# EAGLE schematic Aux Power Board V2.1 (EAGLE 9.6.2)

## Sheet 1 of 2
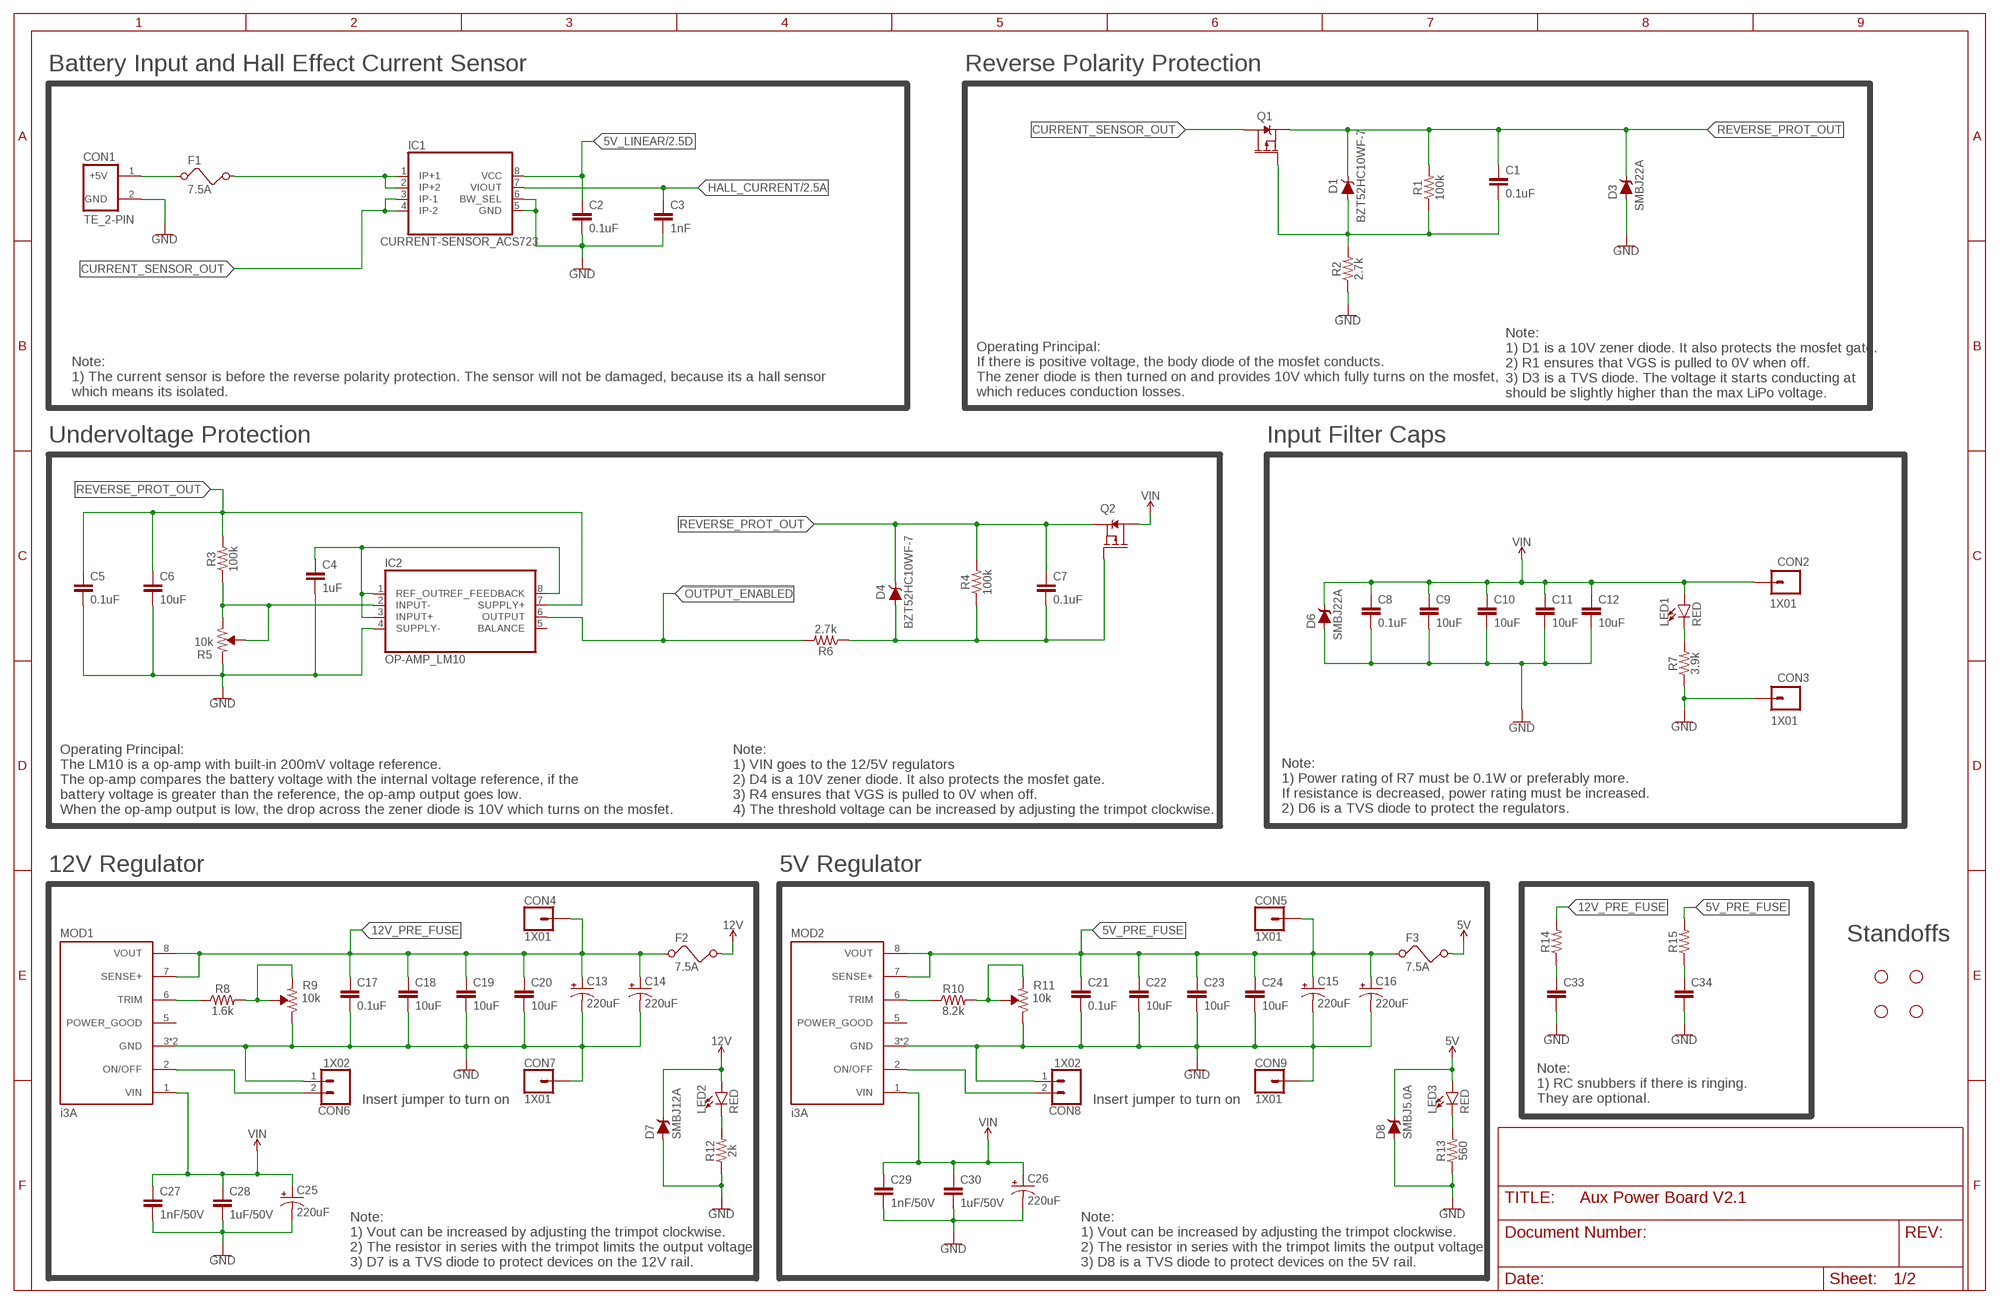
[diagram p0: schematic, sheet 1]

### Parts
C1  0.1uF  CAPACITOR_0805  [0805]
C2  0.1uF  CAPACITOR_0805  [0805]
C3  1nF  CAPACITOR_0805  [0805]
C4  1uF  CAPACITOR_0805  [0805]
C5  0.1uF  CAPACITOR_0805  [0805]
C6  10uF  CAPACITOR_1210  [1210]
C7  0.1uF  CAPACITOR_0805  [0805]
C8  0.1uF  CAPACITOR_0805  [0805]
C9  10uF  CAPACITOR_1210  [1210]
C10  10uF  CAPACITOR_1210  [1210]
C11  10uF  CAPACITOR_1210  [1210]
C12  10uF  CAPACITOR_1210  [1210]
C13  220uF  CAPACITOR_ELECTROLYTIC_220UF  [CAPACITOR_220UF_63V]
C14  220uF  CAPACITOR_ELECTROLYTIC_220UF  [CAPACITOR_220UF_63V]
C15  220uF  CAPACITOR_ELECTROLYTIC_220UF  [CAPACITOR_220UF_63V]
C16  220uF  CAPACITOR_ELECTROLYTIC_220UF  [CAPACITOR_220UF_63V]
C17  0.1uF  CAPACITOR_0805  [0805]
C18  10uF  CAPACITOR_0805  [0805]
C19  10uF  CAPACITOR_0805  [0805]
C20  10uF  CAPACITOR_0805  [0805]
C21  0.1uF  CAPACITOR_0805  [0805]
C22  10uF  CAPACITOR_0805  [0805]
C23  10uF  CAPACITOR_0805  [0805]
C24  10uF  CAPACITOR_0805  [0805]
C25  220uF  CAPACITOR_ELECTROLYTIC_220UF  [CAPACITOR_220UF_63V]
C26  220uF  CAPACITOR_ELECTROLYTIC_220UF  [CAPACITOR_220UF_63V]
C27  1nF/50V  CAPACITOR_0805  [0805]
C28  1uF/50V  CAPACITOR_0805  [0805]
C29  1nF/50V  CAPACITOR_0805  [0805]
C30  1uF/50V  CAPACITOR_0805  [0805]
C33  CAPACITOR_0805  [0805]
C34  CAPACITOR_0805  [0805]
CON1  TE_2-PIN  [TE_2-PIN]
CON2  1X01  [1X01]
CON3  1X01  [1X01]
CON4  1X01  [1X01]
CON5  1X01  [1X01]
CON6  1X02  [1X02]
CON7  1X01  [1X01]
CON8  1X02  [1X02]
CON9  1X01  [1X01]
D1  BZT52HC10WF-7  DIODE_ZENER_SOD123F  [SOD123FL]
D3  SMBJ22A  DIODE_TVS_UNI_DO-214AA  [DO214AA]
D4  BZT52HC10WF-7  DIODE_ZENER_SOD123F  [SOD123FL]
D6  SMBJ22A  DIODE_TVS_UNI_DO-214AA  [DO214AA]
D7  SMBJ12A  DIODE_TVS_UNI_DO-214AA  [DO214AA]
D8  SMBJ5.0A  DIODE_TVS_UNI_DO-214AA  [DO214AA]
F1  7.5A  FUSEHOLDER_VERTICAL  [FUSEHOLDER_VERTICAL]
F2  7.5A  FUSEHOLDER_VERTICAL  [FUSEHOLDER_VERTICAL]
F3  7.5A  FUSEHOLDER_VERTICAL  [FUSEHOLDER_VERTICAL]
H1  STAND-OFF  [STAND-OFF]
H2  STAND-OFF  [STAND-OFF]
H3  STAND-OFF  [STAND-OFF]
H4  STAND-OFF  [STAND-OFF]
IC1  CURRENT-SENSOR_ACS723  [SOIC8]
IC2  OP-AMP_LM10  [DIP08]
LED1  RED  LED_0805  [0805_LED]
LED2  RED  LED_0805  [0805_LED]
LED3  RED  LED_0805  [0805_LED]
MOD1  i3A  CONVERTER_I3A  [CONVERTER_I3A]
MOD2  i3A  CONVERTER_I3A  [CONVERTER_I3A]
Q1  MOSFET_PMOS_TO-263  [TO-263/D2PAK]
Q2  MOSFET_PMOS_TO-263  [TO-263/D2PAK]
R1  100k  RESISTOR_0805  [0805]
R2  2.7k  RESISTOR_0805  [0805]
R3  100k  RESISTOR_0805  [0805]
R4  100k  RESISTOR_0805  [0805]
R5  10k  RESISTOR_TRIMPOT  [TRIMPOT]
R6  2.7k  RESISTOR_0805  [0805]
R7  3.9k  RESISTOR_0805  [0805]
R8  1.6k  RESISTOR_0805  [0805]
R9  10k  RESISTOR_TRIMPOT  [TRIMPOT]
R10  8.2k  RESISTOR_0805  [0805]
R11  10k  RESISTOR_TRIMPOT  [TRIMPOT]
R12  2k  RESISTOR_0805  [0805]
R13  560  RESISTOR_0805  [0805]
R14  RESISTOR_0805  [0805]
R15  RESISTOR_0805  [0805]

### Nets
5V: D8.C F3.3 F3.4 LED3.1(A) ; also sheet 2
5V_LINEAR: C2.1 IC1.8(VCC) ; also sheet 2
5V_PRE_FUSE: C15.+ C16.+ C21.1 C22.1 C23.1 C24.1 CON5.1 F3.1 F3.2 MOD2.7(SENSE+) MOD2.8(VOUT) R15.2
12V: D7.C F2.3 F2.4 LED2.1(A) ; also sheet 2
12V_PRE_FUSE: C13.+ C14.+ C17.1 C18.1 C19.1 C20.1 CON4.1 F2.1 F2.2 MOD1.7(SENSE+) MOD1.8(VOUT) R14.2
!OUTPUT_ENABLED: IC2.6(OUTPUT) R6.2
BATTERY_IN: CON1.1(+5V) F1.1 F1.2
CURRENT_SENSOR_IN: F1.3 F1.4 IC1.1(IP+1) IC1.2(IP+2)
CURRENT_SENSOR_OUT: IC1.3(IP-1) IC1.4(IP-2) Q1.2(D)
GND: C2.2 C3.2 C4.2 C5.2 C6.2 C8.2 C9.2 C10.2 C11.2 C12.2 C13.- C14.- C15.- C16.- C17.2 C18.2 C19.2 C20.2 C21.2 C22.2 C23.2 C24.2 C25.- C26.- C27.2 C28.2 C29.2 C30.2 C33.2 C34.2 CON1.2(GND) CON3.1 CON6.1 CON7.1 CON8.1 CON9.1 D3.A D6.A D7.A D8.A IC1.5(GND) IC1.6(BW_SEL) IC2.4(SUPPLY-) MOD1.3(GND) MOD1.4(GND) MOD2.3(GND) MOD2.4(GND) R2.1 R5.1(CCW) R7.1 R9.3(CW) R11.3(CW) R12.1 R13.1 ; also sheet 2
HALL_CURRENT: C3.1 IC1.7(VIOUT) ; also sheet 2
N$3: MOD1.6(TRIM) R8.1
N$4: LED1.2(C) R7.2
N$5: C4.1 IC2.1(REF_OUT) IC2.3(INPUT+) IC2.8(REF_FEEDBACK)
N$6: IC2.2(INPUT-) R3.1 R5.2(WIPER) R5.3(CW)
N$7: R8.2 R9.1(CCW) R9.2(WIPER)
N$8: C7.2 D4.A Q2.1(G) R4.1 R6.1
N$9: C33.1 R14.1
N$11: MOD2.6(TRIM) R10.1
N$13: LED3.2(C) R13.2
N$14: C1.2 D1.A Q1.1(G) R1.1 R2.2
N$15: C34.1 R15.1
N$17: LED2.2(C) R12.2
N$26: R10.2 R11.1(CCW) R11.2(WIPER)
N$30: CON6.2 MOD1.2(ON/OFF)
N$33: CON8.2 MOD2.2(ON/OFF)
REVERSE_PROT_OUT: C1.1 C5.1 C6.1 C7.1 D1.C D3.C D4.C IC2.7(SUPPLY+) Q1.3(S) Q2.3(S) R1.2 R3.2 R4.2
VIN: C8.1 C9.1 C10.1 C11.1 C12.1 C25.+ C26.+ C27.1 C28.1 C29.1 C30.1 CON2.1 D6.C LED1.1(A) MOD1.1(VIN) MOD2.1(VIN) Q2.2(D) ; also sheet 2
Unconnected: IC2.5(BALANCE) MOD1.5(POWER_GOOD) MOD2.5(POWER_GOOD)

### Notes on the sheet
- Battery Input and Hall Effect Current Sensor | Reverse Polarity Protection
- Note: 
  1) The current sensor is before the reverse polarity protection. The sensor will not be damaged, because its a hall sensor
  which means its isolated.
- Operating Principal: 
  If there is positive voltage, the body diode of the mosfet conducts.
  The zener diode is then turned on and provides 10V which fully turns on the mosfet, 
  which reduces conduction losses.
- Note: 
  1) D1 is a 10V zener diode. It also protects the mosfet gate.
  2) R1 ensures that VGS is pulled to 0V when off.
  3) D3 is a TVS diode. The voltage it starts conducting at 
  should be slightly higher than the max LiPo voltage.
- Undervoltage Protection | Input Filter Caps
- Note: 
  1) Power rating of R7 must be 0.1W or preferably more.
  If resistance is decreased, power rating must be increased.
  2) D6 is a TVS diode to protect the regulators.
- Operating Principal: 
  The LM10 is a op-amp with built-in 200mV voltage reference.
  The op-amp compares the battery voltage with the internal voltage reference, if the 
  battery voltage is greater than the reference, the op-amp output goes low. 
  When the op-amp output is low, the drop across the zener diode is 10V which turns on the mosfet.
- Note: 
  1) VIN goes to the 12/5V regulators
  2) D4 is a 10V zener diode. It also protects the mosfet gate. 
  3) R4 ensures that VGS is pulled to 0V when off.
  4) The threshold voltage can be increased by adjusting the trimpot clockwise.
- 12V Regulator | 5V Regulator
- Standoffs
- Note: 
  1) RC snubbers if there is ringing. 
  They are optional.
- Insert jumper to turn on | Insert jumper to turn on
- Note: 
  1) Vout can be increased by adjusting the trimpot clockwise.
  2) The resistor in series with the trimpot limits the output voltage.
  3) D7 is a TVS diode to protect devices on the 12V rail.
- Note: 
  1) Vout can be increased by adjusting the trimpot clockwise.
  2) The resistor in series with the trimpot limits the output voltage.
  3) D8 is a TVS diode to protect devices on the 5V rail.

## Sheet 2 of 2
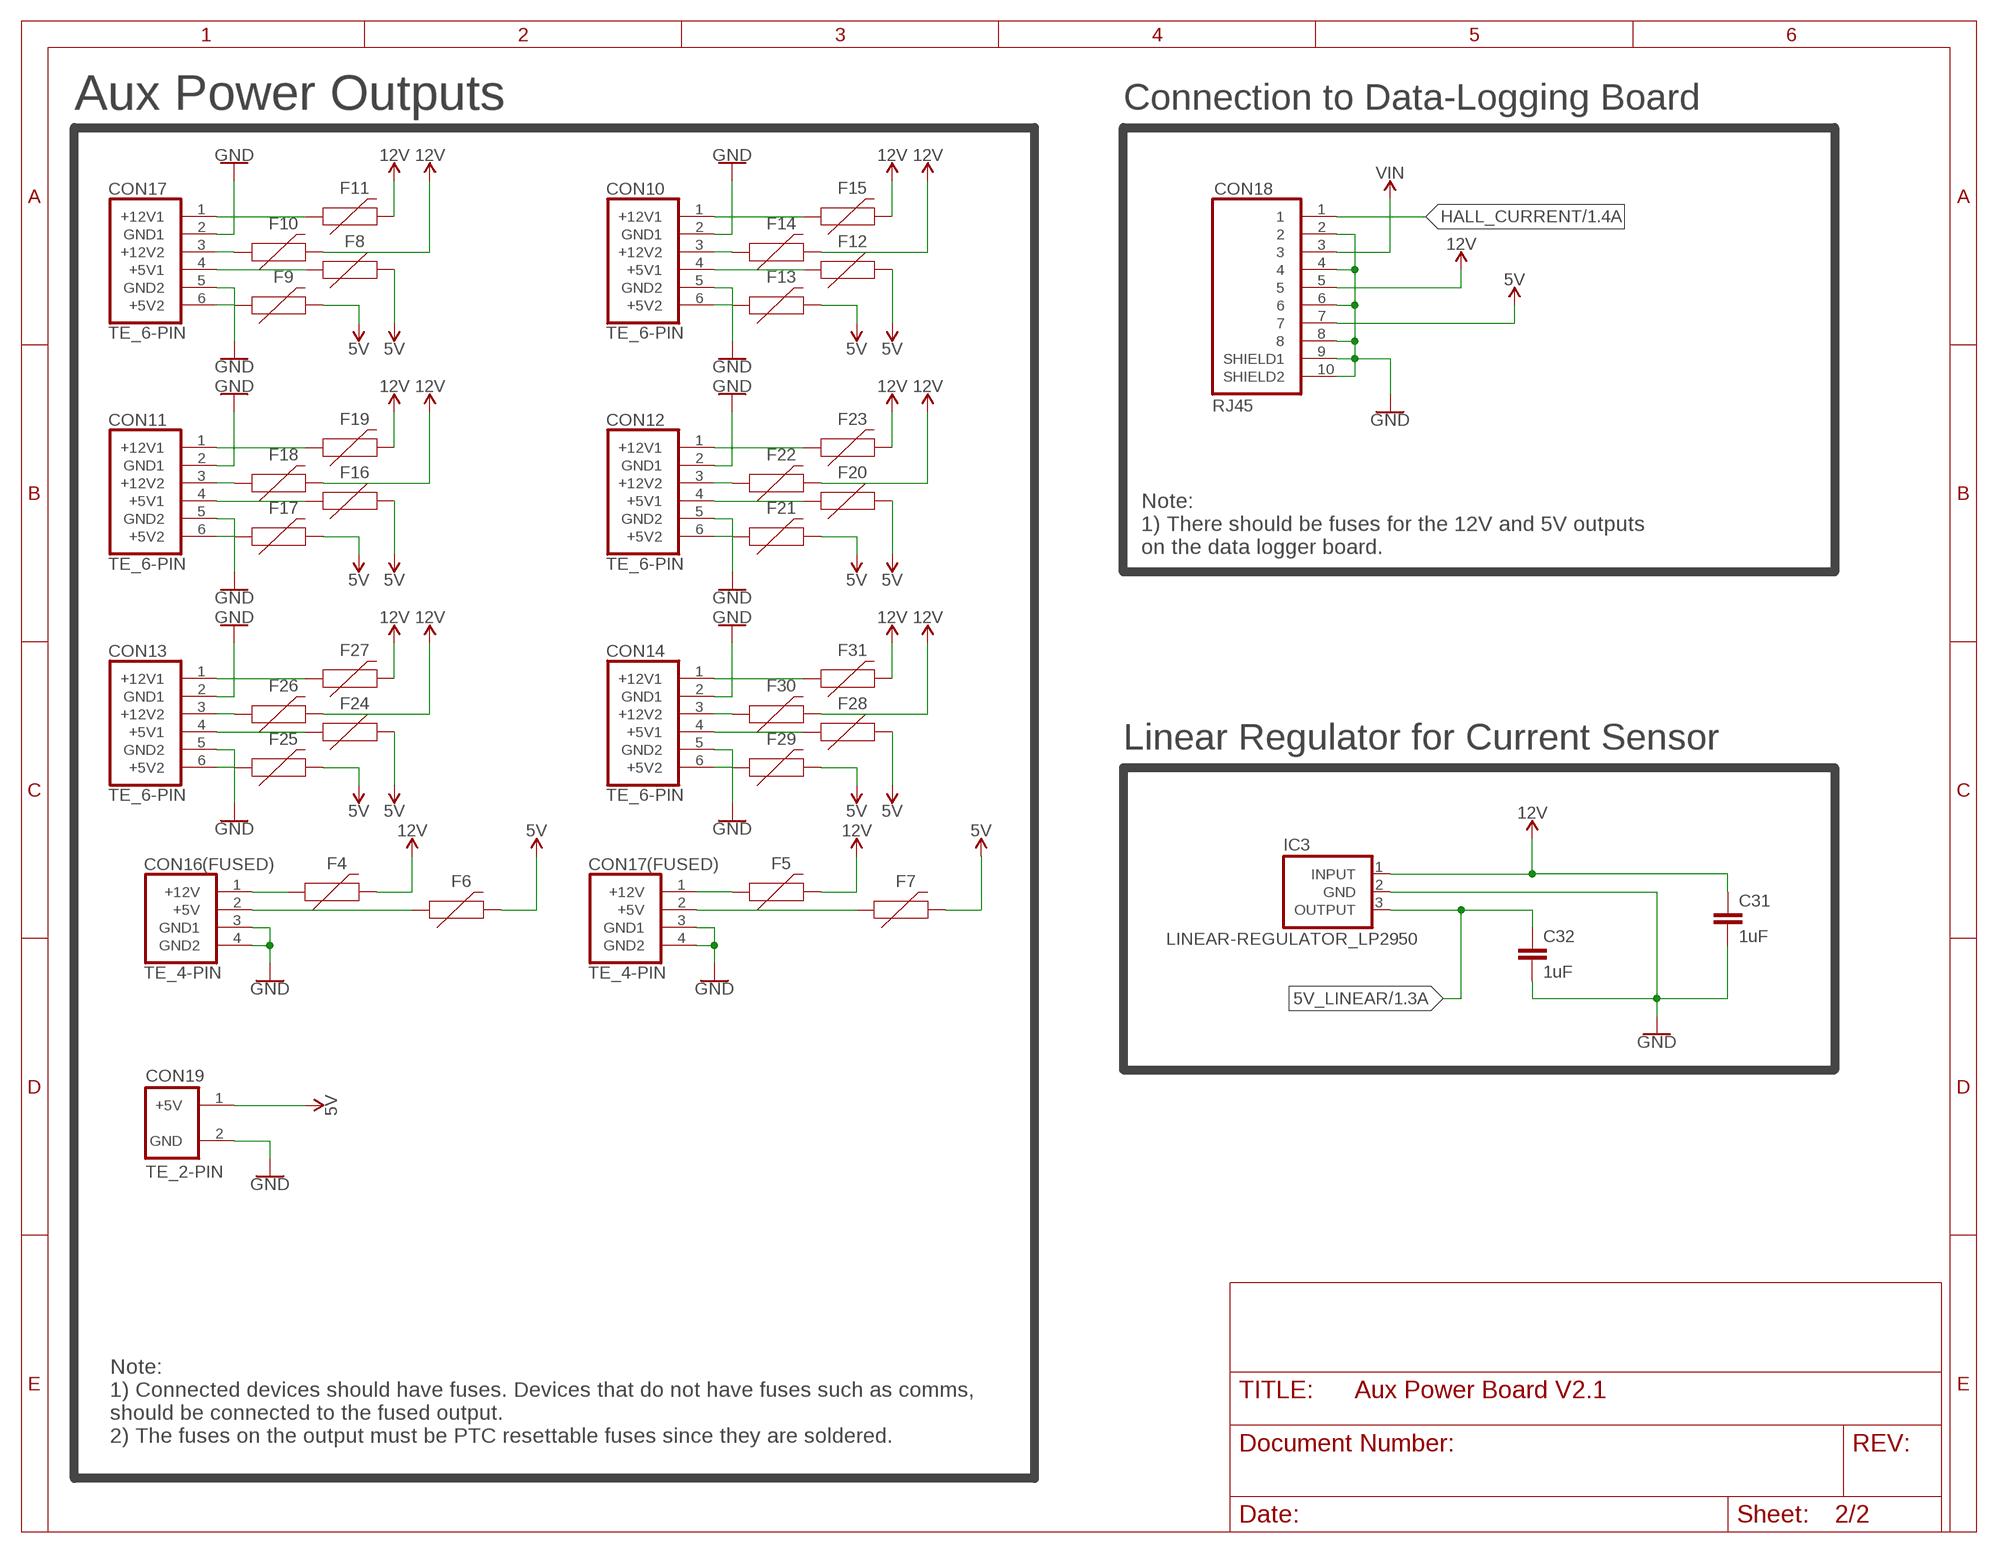
[diagram p1: schematic, sheet 2]

### Parts
C31  1uF  CAPACITOR_0805  [0805]
C32  1uF  CAPACITOR_0805  [0805]
CON10  TE_6-PIN  [TE_6-PIN]
CON11  TE_6-PIN  [TE_6-PIN]
CON12  TE_6-PIN  [TE_6-PIN]
CON13  TE_6-PIN  [TE_6-PIN]
CON14  TE_6-PIN  [TE_6-PIN]
CON16(FUSED)  TE_4-PIN  [TE_4-PIN]
CON17  TE_6-PIN  [TE_6-PIN]
CON17(FUSED)  TE_4-PIN  [TE_4-PIN]
CON18  RJ45  [RJ45]
CON19  TE_2-PIN  [TE_2-PIN]
F4  FUSE_1210_RESETTABLE  [1210]
F5  FUSE_1210_RESETTABLE  [1210]
F6  FUSE_1210_RESETTABLE  [1210]
F7  FUSE_1210_RESETTABLE  [1210]
F8  FUSE_1210_RESETTABLE  [1210]
F9  FUSE_1210_RESETTABLE  [1210]
F10  FUSE_1210_RESETTABLE  [1210]
F11  FUSE_1210_RESETTABLE  [1210]
F12  FUSE_1210_RESETTABLE  [1210]
F13  FUSE_1210_RESETTABLE  [1210]
F14  FUSE_1210_RESETTABLE  [1210]
F15  FUSE_1210_RESETTABLE  [1210]
F16  FUSE_1210_RESETTABLE  [1210]
F17  FUSE_1210_RESETTABLE  [1210]
F18  FUSE_1210_RESETTABLE  [1210]
F19  FUSE_1210_RESETTABLE  [1210]
F20  FUSE_1210_RESETTABLE  [1210]
F21  FUSE_1210_RESETTABLE  [1210]
F22  FUSE_1210_RESETTABLE  [1210]
F23  FUSE_1210_RESETTABLE  [1210]
F24  FUSE_1210_RESETTABLE  [1210]
F25  FUSE_1210_RESETTABLE  [1210]
F26  FUSE_1210_RESETTABLE  [1210]
F27  FUSE_1210_RESETTABLE  [1210]
F28  FUSE_1210_RESETTABLE  [1210]
F29  FUSE_1210_RESETTABLE  [1210]
F30  FUSE_1210_RESETTABLE  [1210]
F31  FUSE_1210_RESETTABLE  [1210]
IC3  LINEAR-REGULATOR_LP2950  [TO92]

### Nets
5V: CON18.7 CON19.1(+5V) F6.2 F7.2 F8.2 F9.2 F12.2 F13.2 F16.2 F17.2 F20.2 F21.2 F24.2 F25.2 F28.2 F29.2 ; also sheet 1
5V_LINEAR: C32.1 IC3.3(OUTPUT) ; also sheet 1
12V: C31.1 CON18.5 F4.2 F5.2 F10.2 F11.2 F14.2 F15.2 F18.2 F19.2 F22.2 F23.2 F26.2 F27.2 F30.2 F31.2 IC3.1(INPUT) ; also sheet 1
+5V: CON17.6(+5V2) F9.1
+5V1: CON10.6(+5V2) F13.1
+5V2: CON11.6(+5V2) F17.1
+5V3: CON12.6(+5V2) F21.1
+5V4: CON13.6(+5V2) F25.1
+5V5: CON14.6(+5V2) F29.1
+12V: CON17.1(+12V1) F11.1
+12V1: CON10.1(+12V1) F15.1
+12V2: CON11.1(+12V1) F19.1
+12V3: CON12.1(+12V1) F23.1
+12V4: CON13.1(+12V1) F27.1
+12V5: CON14.1(+12V1) F31.1
GND: C31.2 C32.2 CON10.2(GND1) CON10.5(GND2) CON11.2(GND1) CON11.5(GND2) CON12.2(GND1) CON12.5(GND2) CON13.2(GND1) CON13.5(GND2) CON14.2(GND1) CON14.5(GND2) CON16(FUSED).3(GND1) CON16(FUSED).4(GND2) CON17(FUSED).3(GND1) CON17(FUSED).4(GND2) CON17.2(GND1) CON17.5(GND2) CON18.2 CON18.4 CON18.6 CON18.8 CON18.9(SHIELD1) CON18.10(SHIELD2) CON19.2(GND) IC3.2(GND) ; also sheet 1
HALL_CURRENT: CON18.1 ; also sheet 1
N$1: CON16(FUSED).2(+5V) F6.1
N$2: CON16(FUSED).1(+12V) F4.1
N$10: CON17(FUSED).1(+12V) F5.1
N$12: CON17(FUSED).2(+5V) F7.1
N$16: CON10.3(+12V2) F14.1
N$18: CON17.3(+12V2) F10.1
N$19: CON10.4(+5V1) F12.1
N$20: CON17.4(+5V1) F8.1
N$21: CON11.3(+12V2) F18.1
N$22: CON11.4(+5V1) F16.1
N$23: CON12.3(+12V2) F22.1
N$24: CON12.4(+5V1) F20.1
N$25: CON13.3(+12V2) F26.1
N$27: CON13.4(+5V1) F24.1
N$28: CON14.3(+12V2) F30.1
N$29: CON14.4(+5V1) F28.1
VIN: CON18.3 ; also sheet 1

### Notes on the sheet
- Aux Power Outputs | Connection to Data-Logging Board
- Note: 
  1) There should be fuses for the 12V and 5V outputs
  on the data logger board.
- Linear Regulator for Current Sensor
- Note: 
  1) Connected devices should have fuses. Devices that do not have fuses such as comms, 
  should be connected to the fused output.
  2) The fuses on the output must be PTC resettable fuses since they are soldered.

## Library data of the parts
C1-C5 C7 C8 C17-C24 C27-C34 = EcoCar-Passives:CAPACITOR_0805
C6 C9-C12 = EcoCar-Passives:CAPACITOR_1210
C13-C16 C25 C26 = EcoCar-Passives:CAPACITOR_ELECTROLYTIC_220UF: 63V 220uF Low ESR Capacitor Manufacturer: Panasonic Series: FR Part Number: EEU-FR1J221L Digikey Part Number: P15409-ND
CON1 CON19 = EcoCar-Connectors:TE_2-PIN: 2 Pin TE Mini-Universal MATE-N-LOK - Use for signals and power connections Part Number: 1-770966-0 Digikey Part Number: A32471-ND Matching Plug: A25587-ND Matching Crimps: A100828CT-ND
CON2-CON5 CON7 CON9 = EcoCar-Connectors-2.54mm:1X01: 2.54mm (0.1") Header
CON6 CON8 = EcoCar-Connectors-2.54mm:1X02: 2.54mm (0.1") Header
CON10-CON14 CON17 = EcoCar-Connectors:TE_6-PIN: 6 Pin TE Mini-Universal MATE-N-LOK Part Number: 1-770969-0 Digikey Part Number: A32475-ND Matching Plug: A97674-ND Matching Crimps: A100828CT-ND
CON16(FUSED) CON17(FUSED) = EcoCar-Connectors:TE_4-PIN: 4 Pin TE Mini-Universal MATE-N-LOK - Use for 12V and 5V connections Part Number: 1-770968-0 Digikey Part Number: A32474-ND Matching Plug: A25571-ND Matching Crimps: A100828CT-ND
CON18 = EcoCar-Connectors:RJ45: RJ45 Connector - Use for signals and low power connections Unshielded Part Number: RJHSE-5080 Unshielded Digikey Part Number: RJHSE-5080-ND Shielded Part Number: RJHSE5E80 Shielded Digikey Part Number: RJHSE5E80-ND
D1 D4 = EcoCar-Discrete-Semiconductors:DIODE_ZENER_SOD123F
D3 D6-D8 = EcoCar-Fuses-Protection:DIODE_TVS_UNI_DO-214AA
F1-F3 = EcoCar-Fuses-Protection:FUSEHOLDER_VERTICAL: Vertical Fuse Holder for Mini Blade Fuses Manufacturer: Keystone Part Number: 3568 Digikey Part Number: 36-3568-ND
F4-F31 = EcoCar-Fuses-Protection:FUSE_1210_RESETTABLE: 1210 Resettable PTC Fuse
H1-H4 = EcoCar-Miscellaneous:STAND-OFF: Stand Off Drill holes for mechanically mounting via screws, standoffs, etc. Note: Use the keepout ring to avoid running the screw head into surrounding components. Variant Overviews STAND-OFF - Mechanical footprint for a #4 phillips button head screw. STAND-OFF-TIGHT - Mechanical footprint for a #4 phillips button head screw, Example SparkFun Products Screw - Phillips Head (1/4", 4-40, 10 pack) <https://www.sparkfun.com/products/10453> (PRT-10453) Screw - Phillips Head (1/2", 4-40, 10 pack) <https://www.sparkfun.com/products/10452> (PRT-10452) Screw - Phillips Head (3/4", 4-40, 10 pack) <https://www.sparkfun.com/products/10451> (PRT-10451) Screw - Phillips Head (1", 4-40, 10 pack) <https://www.sparkfun.com/products/10450> (PRT-10450)
IC1 = EcoCar-Integrated-Circuits:CURRENT-SENSOR_ACS723: 10A Hall Effect Current Sensor Manufacturer: Allegro MicroSystems Part Number: ACS723LLCTR-10AU-T Digikey Part Number: 620-1643-1-ND Note: pinout fixed Nov 28, 2019
IC2 = EcoCar-Integrated-Circuits:OP-AMP_LM10: Op-Amp with Internal Voltage Reference Manufacturer: Texas Instruments Part Number: LM10CN/NOPB Digikey Part Number: LM10CN/NOPB-ND
IC3 = EcoCar-Integrated-Circuits:LINEAR-REGULATOR_LP2950: 5V Linear Regulator Manufacturer: Texas Instruments Part Number: LP2950-50LPRE3 Digikey Part Number: 296-20933-1-ND
LED1-LED3 = EcoCar-Discrete-Semiconductors:LED_0805
MOD1 MOD2 = EcoCar-Modules:CONVERTER_I3A: i3A Buck Module (for 12/5V out) Manufacturer: TDK-Lambda Part Number: I3A4W008A033V-001-R Digikey Part Number: 285-2720-ND Note: this version has negative on/off logic and no power good pin
Q1 Q2 = EcoCar-Discrete-Semiconductors:MOSFET_PMOS_TO-263
R1-R4 R6-R8 R10 R12-R15 = EcoCar-Passives:RESISTOR_0805
R5 R9 R11 = EcoCar-Passives:RESISTOR_TRIMPOT: Bourns Trimpot Example Part: 10k trimpot Manufacturer: Bourns Part Number: PV36W103C01B00 Digikey Part Number: 490-2875-ND